# Altium schematic sheet ControlBrickLogic2_0.SchDoc
size A4
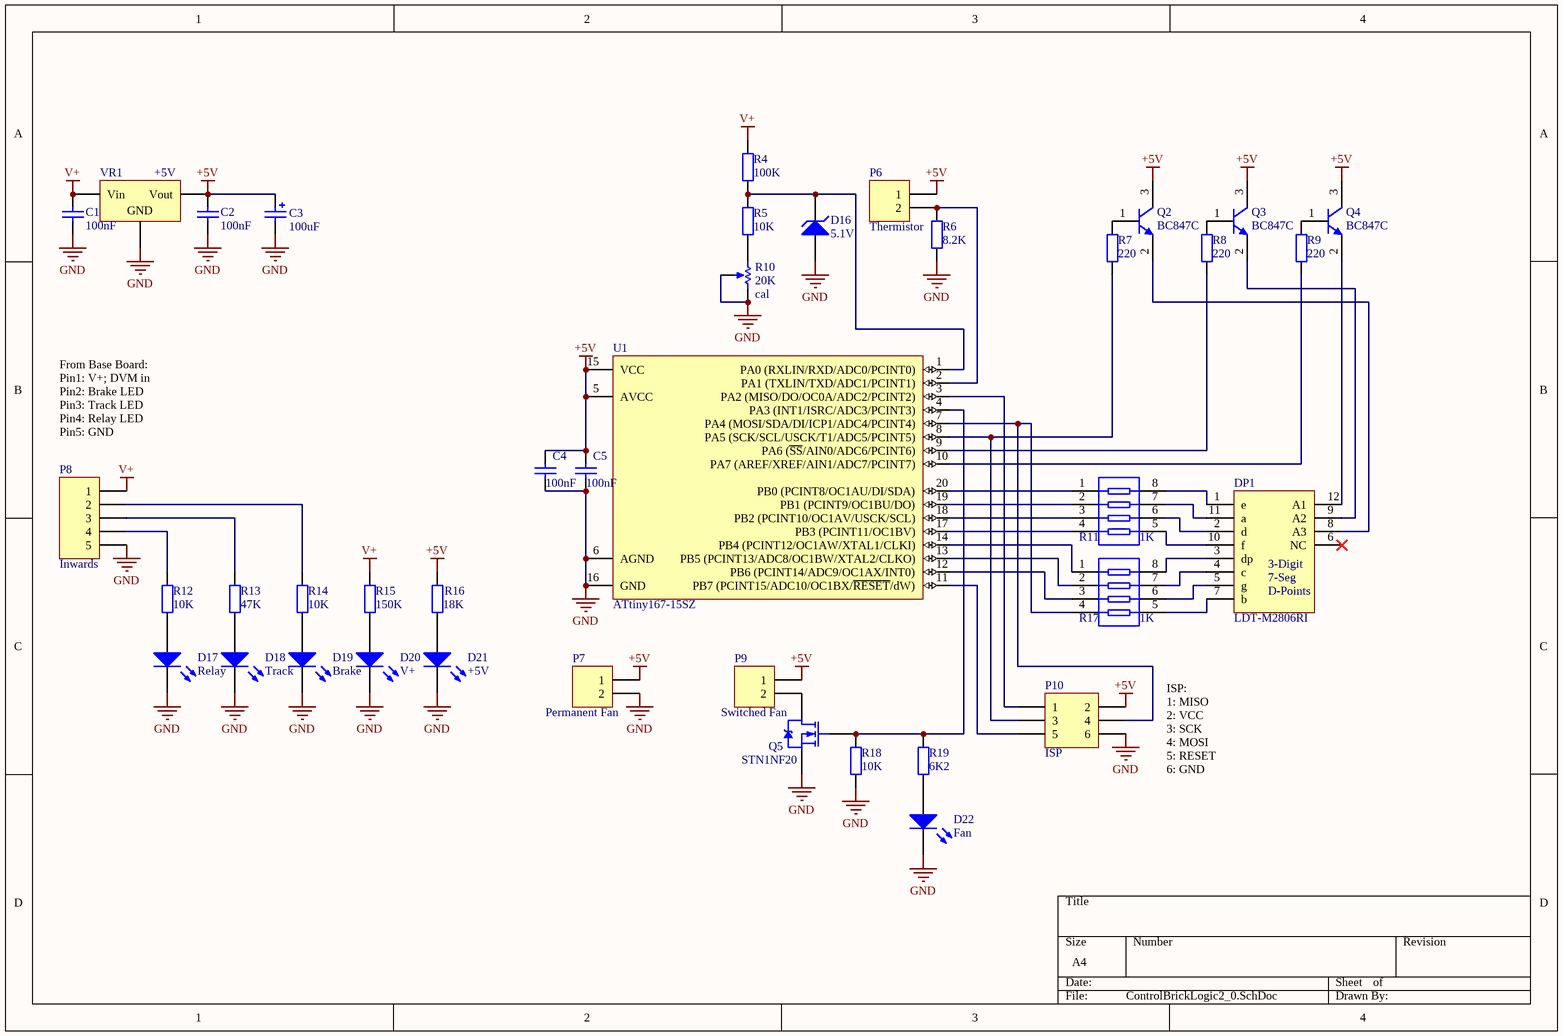
[diagram p0: ControlBrickLogic2_0.SchDoc]

## Parts
C1  value 100nF  [1206]  (hidden comment: CapSMD)
C2  value 100nF  [1206]  (hidden comment: CapSMD)
C3  value 100uF  [SMDcap 5mm]  (hidden comment: Supercap)
C4  value 100nF  [1206]  (hidden comment: CapSMD)
C5  value 100nF  [1206]  (hidden comment: CapSMD)
D16  5.1V  [MiniMELF]
D17  Relay  [LED 2.54]
D18  Track  [LED 2.54]
D19  Brake  [LED 2.54]
D20  V+  [LED 2.54]
D21  +5V  [LED 2.54]
D22  Fan  [LED 2.54]
DP1  LDT-M2806RI  [LDT-M2806RI]
P6  Thermistor  [HDR1X2]
P7  Permanent Fan  [HDR1X2]
P8  Inwards  [HDR1X5]
P9  Switched Fan  [HDR1X2]
P10  ISP  [HDR2X3]
Q2  BC847C  [SOT23]
Q3  BC847C  [SOT23]
Q4  BC847C  [SOT23]
Q5  STN1NF20  [SOT223]
R4  value 100K  [1206]  (hidden comment: ResSMD)
R5  value 10K  [1206]  (hidden comment: ResSMD)
R6  value 8.2K  [1206]  (hidden comment: ResSMD)
R7  value 220  [1206]  (hidden comment: ResSMD)
R8  value 220  [1206]  (hidden comment: ResSMD)
R9  value 220  [1206]  (hidden comment: ResSMD)
R10  cal  value 20K  [Tr3296P]
R11  1K  [ResNet1206_8]
R12  value 10K  [1206]  (hidden comment: ResSMD)
R13  value 47K  [1206]  (hidden comment: ResSMD)
R14  value 10K  [1206]  (hidden comment: ResSMD)
R15  value 150K  [1206]  (hidden comment: ResSMD)
R16  value 18K  [1206]  (hidden comment: ResSMD)
R17  1K  [ResNet1206_8]
R18  value 10K  [1206]  (hidden comment: ResSMD)
R19  value 6K2  [1206]  (hidden comment: ResSMD)
U1  ATtiny167-15SZ  [20TG_N]
VR1  +5V  [DPAK]

## Nets
+5V: C2.2 C3.1 C4.2 C5.2 P6.1 P7.1 P9.1 P10.2 Q2.3(C) Q3.3(C) Q4.3(C) R16.2 U1.5(AVCC) U1.15(VCC) VR1.3(Vout)
GND: C1.1 C2.1 C3.2 C4.1 C5.1 D16.1(A) D17.2(K) D18.2(K) D19.2(K) D20.2(K) D21.2(K) D22.2(K) P7.2 P8.5 P10.6 Q5.3(S) R6.1 R10.2(BOT) R10.3(TAP) R18.1 U1.6(AGND) U1.16(GND) VR1.2(GND)
V+: C1.2 P8.1 R4.2 R15.2 VR1.1(Vin)
NetD16_2: D16.2(K) R4.1 R5.2 U1.1(PA0_(RXLIN/RXD/ADC0/PCINT0))
NetD17_1: D17.1(A) R12.1
NetD18_1: D18.1(A) R13.1
NetD19_1: D19.1(A) R14.1
NetD20_1: D20.1(A) R15.1
NetD21_1: D21.1(A) R16.1
NetD22_1: D22.1(A) R19.1
NetDP1_1: DP1.1(e) R11.8
NetDP1_2: DP1.2(d) R11.6
NetDP1_3: DP1.3(dp) R17.8
NetDP1_4: DP1.4(c) R17.7
NetDP1_5: DP1.5(g) R17.6
NetDP1_7: DP1.7(b) R17.5
NetDP1_8: DP1.8(A3) Q2.2(E)
NetDP1_9: DP1.9(A2) Q3.2(E)
NetDP1_10: DP1.10(f) R11.5
NetDP1_11: DP1.11(a) R11.7
NetDP1_12: DP1.12(A1) Q4.2(E)
NetP6_2: P6.2 R6.2 U1.2(PA1_(TXLIN/TXD/ADC1/PCINT1))
NetP8_2: P8.2 R14.2
NetP8_3: P8.3 R13.2
NetP8_4: P8.4 R12.2
NetP9_2: P9.2 Q5.2(D)
NetP10_1: P10.1 U1.3(PA2_(MISO/DO/OC0A/ADC2/PCINT2))
NetP10_3: P10.3 R7.1 U1.8(PA5_(SCK/SCL/USCK/T1/ADC5/PCINT5))
NetP10_4: P10.4 R17.4 U1.7(PA4_(MOSI/SDA/DI/ICP1/ADC4/PCINT4))
NetP10_5: P10.5 U1.11(PB7_(PCINT15/ADC10/OC1BX/~{RESET}/dW))
NetQ2_1: Q2.1(B) R7.2
NetQ3_1: Q3.1(B) R8.2
NetQ4_1: Q4.1(B) R9.2
NetQ5_1: Q5.1(G) R18.2 R19.2 U1.4(PA3_(INT1/ISRC/ADC3/PCINT3))
NetR5_1: R5.1 R10.1(TOP)
NetR8_1: R8.1 U1.9(PA6_(~{SS}/AIN0/ADC6/PCINT6))
NetR9_1: R9.1 U1.10(PA7_(AREF/XREF/AIN1/ADC7/PCINT7))
NetR11_1: R11.1 U1.20(PB0_(PCINT8/OC1AU/DI/SDA))
NetR11_2: R11.2 U1.19(PB1_(PCINT9/OC1BU/DO))
NetR11_3: R11.3 U1.18(PB2_(PCINT10/OC1AV/USCK/SCL))
NetR11_4: R11.4 U1.17(PB3_(PCINT11/OC1BV))
NetR17_1: R17.1 U1.14(PB4_(PCINT12/OC1AW/XTAL1/CLKI))
NetR17_2: R17.2 U1.13(PB5_(PCINT13/ADC8/OC1BW/XTAL2/CLKO))
NetR17_3: R17.3 U1.12(PB6_(PCINT14/ADC9/OC1AX/INT0))

Not connected (* = marked no-connect by the designer): DP1 6(NC)*

## Notes on the sheet
- From Base Board:
  Pin1: V+; DVM in
  Pin2: Brake LED
  Pin3: Track LED
  Pin4: Relay LED
  Pin5: GND
- ISP:
  1: MISO
  2: VCC
  3: SCK
  4: MOSI
  5: RESET
  6: GND
- (in symbol 7Seg) 3-Digit; 7-Seg; D-Points

## Library data of the parts
C1 C2 C4 C5 = CapSMD: Capacitor; Published: 8-Jun-2000; LatestRevisionDate: 17-Jul-2002; LatestRevisionNote: Re-released for DXP Platform.; PackageReference: RAD-0.3; Publisher: Altium Limited; PackageDescription: Radial Cap, Thru-Hole; 2 Leads; 0.3 in Pin Spacing
C3 = Cap Pol2: Polarized Capacitor (Axial); Published: 8-Jun-2000; LatestRevisionDate: 17-Jul-2002; LatestRevisionNote: Re-released for DXP Platform.; PackageReference: POLAR0.8; Publisher: Altium Limited; PackageDescription: Polarized Capacitor; 2 Leads
D16 = D Zener: Zener Diode; Published: 8-Jun-2000; LatestRevisionDate: 17-Jul-2002; LatestRevisionNote: Re-released for DXP Platform.; PackageReference: DIODE-0.7; Publisher: Altium Limited; PackageDescription: Diode, Thru-Hole; 2 Leads; 0.7 in Pin Spacing
D17-D22 = LED1: Typical RED GaAs LED; Published: 8-Jun-2000; LatestRevisionDate: 08-Jul-2005; LatestRevisionNote: Mech Layer 1 removed.; PackageReference: LED-1; Publisher: Altium Limited; PackageDescription: LED; 2 Leads
DP1 = 7Seg
P6 P7 P9 = Header 2: Header, 2-Pin; LatestRevisionDate: 17-Jul-2002; LatestRevisionNote: Re-released for DXP Platform.; Publisher: Altium Limited
P8 = Header 5: Header, 5-Pin; LatestRevisionDate: 17-Jul-2002; LatestRevisionNote: Re-released for DXP Platform.; Publisher: Altium Limited
P10 = Header 3X2: Header, 3-Pin, Dual row; LatestRevisionDate: 17-Jul-2002; LatestRevisionNote: Re-released for DXP Platform.; Publisher: Altium Limited
Q2-Q4 = BC847C: NPN General Purpose Amplifier; Published: 8-Jun-2000; LatestRevisionDate: 15-Jan-2003; LatestRevisionNote: PCB Footprint 'BCY-W3/D4.7' replaced; DatasheetVersion: 1997; PackageVersion: Sep-1998; PackageReference: TO-92A; Publisher: Altium Limited; PackageDescription: TO, Flat Index; 3 In-Line, Axial Leads; Body Dia. 4.5mm; Leads 0.51 x 0.48 mm (max); ComponentLink1Description: Manufacturer Link; ComponentLink1URL: http://www.fairchildsemi.com/; ComponentLink2Description: Datasheet; ComponentLink2URL: http://www.fairchildsemi.com/ds/2N%2F2N3904.pdf
Q5 = STN1NF20: N-Channel MOSFET, SOT223; Note: Pin 2 is electrically connected to pin 4.; Published: 8-Jun-2000; LatestRevisionDate: 17-Jul-2002; LatestRevisionNote: Re-released for DXP Platform.; DatasheetVersion: PD-9.374G; PackageVersion: Feb-1997; PackageReference: TO-220AB; Publisher: Altium Limited; PackageDescription: TO, Thru-Hole, Vertical, Heatsink Mounted; 3 In-Line Leads; Pitch 2.54 mm; ComponentLink1Description: Manufacturer Link; ComponentLink1URL: http://www.irf.com/; ComponentLink2Description: Datasheet; ComponentLink2URL: http://www.irf.com/product-info/datasheets/data/irf640.pdf
R4-R9 R12-R16 R18 R19 = ResSMD: Resistor; Published: 8-Jun-2000; LatestRevisionDate: 17-Jul-2002; LatestRevisionNote: Re-released for DXP Platform.; PackageReference: AXIAL-0.4; Publisher: Altium Limited; PackageDescription: Axial Device, Thru-Hole; 2 Leads; 0.4 in Pin Spacing
R10 = RPot: Potentiometer; pin to pad: 1>2 2>1; Sim Note: Enter the Resistance value and the set point into parameter fields.; Set Position: 0.5; Published: 8-Jun-2000; LatestRevisionDate: 17-Jul-2002; LatestRevisionNote: Re-released for DXP Platform.; PackageReference: VR5; Publisher: Altium Limited; PackageDescription: Variable Resistor, Thru-Hole; 3 Leads
R11 R17 = ResNet4: Isolated Resistor Network
U1 = ATtiny167-15SZ: 8-bit Automotive AVR Microcontroller, 16KB Flash, 512 Bytes EEPROM, 512 Bytes SRAM, Automotive Grade (-40°C to +125°C), 20-Pin SOIC; Published: 1-Apr-2010; DatasheetVersion: revD, Jul-2009; PackageVersion: 2009; PackageReference: 20TG; Publisher: Altium Limited; PackageDescription: 20-pin, 0.300” Wide, Plastic Gull-Wing Small Outline (EIAJ SOIC); Supplier 1: Digi-Key; Supplier Part Number 1: ATTINY167-15SZ-ND; Supplier 2: Mouser; Supplier Part Number 2: 556-ATTINY167-15SZ; Code_JEDEC: MS-013-AC; Code_IPC: SOIC127P1030-20; ComponentLink1Description: Manufacturer Link; ComponentLink1URL: http://www.atmel.com/products/avr/default.asp?; ComponentLink2Description: ATtiny87/ATtiny167 Datasheet; ComponentLink2URL: http://www.atmel.com/dyn/resources/prod_documents/doc7728.pdf; ComponentLink3Description: Atmel.com Home; ComponentLink3URL: http://www.atmel.com
VR1 = Volt Reg: Voltage Regulator; Published: 24-Mar-1999; LatestRevisionDate: 29-May-2009; LatestRevisionNote: IPC-7351 Footprint Added.; PackageReference: D2PAK; Publisher: Altium Limited; PackageDescription: 3-Pin Transistor Outline Package 2.54 mm Pitch, 15.1 mm Lead Span